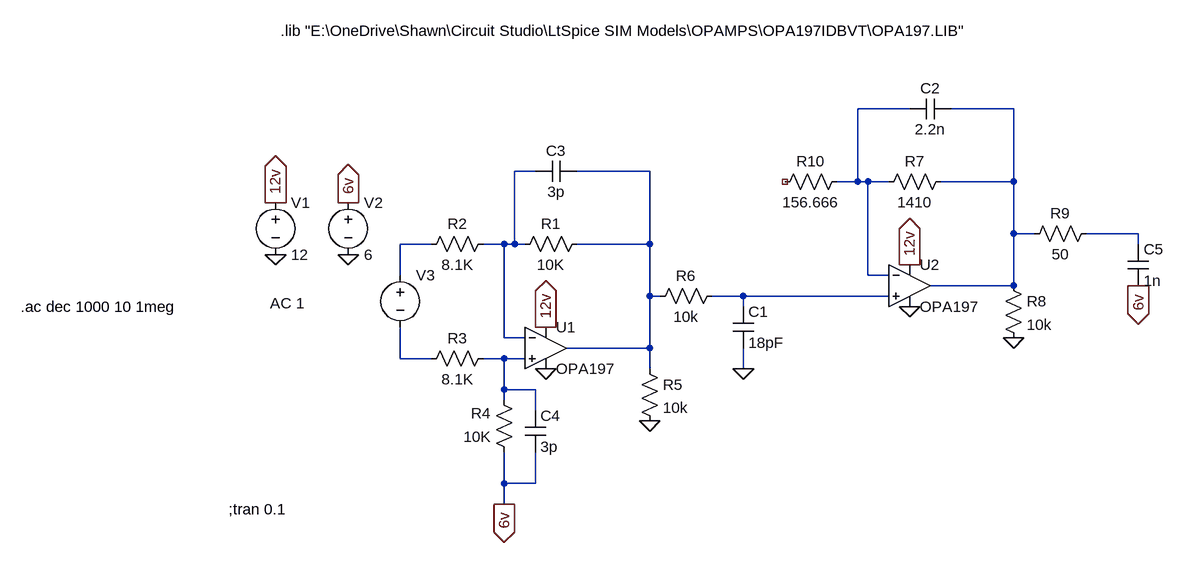
[diagram p0: schematic Amplifer.asc]
Amplifer.asc, the LTspice schematic file:
Version 4
SHEET 1 1096 680
WIRE 672 -224 592 -224
WIRE 832 -224 736 -224
WIRE 96 -128 64 -128
WIRE 272 -128 160 -128
WIRE 592 -112 592 -224
WIRE 592 -112 560 -112
WIRE 608 -112 592 -112
WIRE 640 -112 608 -112
WIRE 832 -112 832 -224
WIRE 832 -112 720 -112
WIRE 832 -32 832 -112
WIRE 864 -32 832 -32
WIRE 1024 -32 944 -32
WIRE -64 -16 -112 -16
WIRE 48 -16 16 -16
WIRE 64 -16 64 -128
WIRE 64 -16 48 -16
WIRE 80 -16 64 -16
WIRE 272 -16 272 -128
WIRE 272 -16 160 -16
WIRE 1024 -16 1024 -32
WIRE -112 32 -112 -16
WIRE 608 32 608 -112
WIRE 640 32 608 32
WIRE 832 48 832 -32
WIRE 832 48 704 48
WIRE 272 64 272 -16
WIRE 288 64 272 64
WIRE 416 64 368 64
WIRE 640 64 416 64
WIRE 416 80 416 64
WIRE 48 128 48 -16
WIRE 80 128 48 128
WIRE 272 144 272 64
WIRE 272 144 144 144
WIRE -112 160 -112 112
WIRE -64 160 -112 160
WIRE 48 160 16 160
WIRE 80 160 48 160
WIRE 272 176 272 144
WIRE 416 176 416 144
WIRE 48 208 48 160
WIRE 96 208 48 208
WIRE 48 224 48 208
WIRE 96 240 96 208
WIRE 48 352 48 304
WIRE 96 352 96 304
WIRE 96 352 48 352
WIRE 48 384 48 352
FLAG -304 0 0
FLAG -304 -80 12v
IOPIN -304 -80 Out
FLAG 112 112 12v
IOPIN 112 112 Out
FLAG -192 0 0
FLAG -192 -80 6v
IOPIN -192 -80 Out
FLAG 112 176 0
FLAG 48 384 6v
IOPIN 48 384 Out
FLAG 272 256 0
FLAG 416 176 0
FLAG 672 16 12v
IOPIN 672 16 Out
FLAG 672 80 0
FLAG 832 128 0
FLAG 1024 48 6v
IOPIN 1024 48 Out
SYMBOL Opamps\\opamp2 112 80 R0
SYMATTR InstName U1
SYMATTR Value OPA197
SYMBOL voltage -304 -96 R0
WINDOW 123 0 0 Left 0
WINDOW 39 0 0 Left 0
SYMATTR InstName V1
SYMATTR Value 12
SYMBOL voltage -192 -96 R0
WINDOW 123 0 0 Left 0
WINDOW 39 0 0 Left 0
SYMATTR InstName V2
SYMATTR Value 6
SYMBOL res 176 -32 R90
WINDOW 0 0 56 VBottom 2
WINDOW 3 32 56 VTop 2
SYMATTR InstName R1
SYMATTR Value 10K
SYMBOL res 32 -32 R90
WINDOW 0 0 56 VBottom 2
WINDOW 3 32 56 VTop 2
SYMATTR InstName R2
SYMATTR Value 8.1K
SYMBOL res 32 144 R90
WINDOW 0 0 56 VBottom 2
WINDOW 3 32 56 VTop 2
SYMATTR InstName R3
SYMATTR Value 8.1K
SYMBOL res 64 320 R180
WINDOW 0 36 76 Left 2
WINDOW 3 36 40 Left 2
SYMATTR InstName R4
SYMATTR Value 10K
SYMBOL voltage -112 16 R0
WINDOW 3 -200 59 Left 2
SYMATTR Value AC 1
SYMATTR InstName V3
SYMBOL Opamps\\opamp2 672 -16 R0
SYMATTR InstName U2
SYMATTR Value OPA197
SYMBOL res 256 160 R0
SYMATTR InstName R5
SYMATTR Value 10k
SYMBOL res 384 48 R90
WINDOW 0 0 56 VBottom 2
WINDOW 3 32 56 VTop 2
SYMATTR InstName R6
SYMATTR Value 10k
SYMBOL cap 400 80 R0
SYMATTR InstName C1
SYMATTR Value 18pF
SYMBOL res 576 -128 R90
WINDOW 0 0 56 VBottom 2
WINDOW 3 32 56 VTop 2
SYMATTR InstName R10
SYMATTR Value 156.666
SYMBOL res 736 -128 R90
WINDOW 0 0 56 VBottom 2
WINDOW 3 32 56 VTop 2
SYMATTR InstName R7
SYMATTR Value 1410
SYMBOL cap 736 -240 R90
WINDOW 0 0 32 VBottom 2
WINDOW 3 32 32 VTop 2
SYMATTR InstName C2
SYMATTR Value 2.2n
SYMBOL cap 160 -144 R90
WINDOW 0 0 32 VBottom 2
WINDOW 3 32 32 VTop 2
SYMATTR InstName C3
SYMATTR Value 3p
SYMBOL cap 80 240 R0
SYMATTR InstName C4
SYMATTR Value 3p
SYMBOL res 816 32 R0
SYMATTR InstName R8
SYMATTR Value 10k
SYMBOL res 960 -48 R90
WINDOW 0 0 56 VBottom 2
WINDOW 3 32 56 VTop 2
SYMATTR InstName R9
SYMATTR Value 50
SYMBOL cap 1008 -16 R0
SYMATTR InstName C5
SYMATTR Value 1n
TEXT -296 -344 Left 2 !.lib "E:\\OneDrive\\Shawn\\Circuit Studio\\LtSpice SIM Models\\OPAMPS\\OPA197IDBVT\\OPA197.LIB"
TEXT -376 392 Left 2 !;tran 0.1
TEXT -696 80 Left 2 !.ac dec 1000 10 1meg

The netlist it stands for:
* Amplifer.asc
XU1 N009 N003 12v 0 N004 OPA197  ; pins In+ In- V+ V- OUT
V1 12v 0 12
V2 6v 0 6
R1 N004 N003 10K
R2 N003 N006 8.1K
R3 N009 N008 8.1K
R4 6v N009 10K
V3 N006 N008 AC 1
XU2 N007 N001 12v 0 N002 OPA197  ; pins In+ In- V+ V- OUT
R5 N004 0 10k
R6 N007 N004 10k
C1 N007 0 18pF
R10 N001 NC_01 156.666
R7 N002 N001 1410
C2 N002 N001 2.2n
C3 N004 N003 3p
C4 N009 6v 3p
R8 N002 0 10k
R9 N005 N002 50
C5 N005 6v 1n
.lib "E:\OneDrive\Shawn\Circuit Studio\LtSpice SIM Models\OPAMPS\OPA197IDBVT\OPA197.LIB"
;tran 0.1
.ac dec 1000 10 1meg
.backanno
.end